# EAGLE schematic New_Point_Absorber (EAGLE 9.5.2)
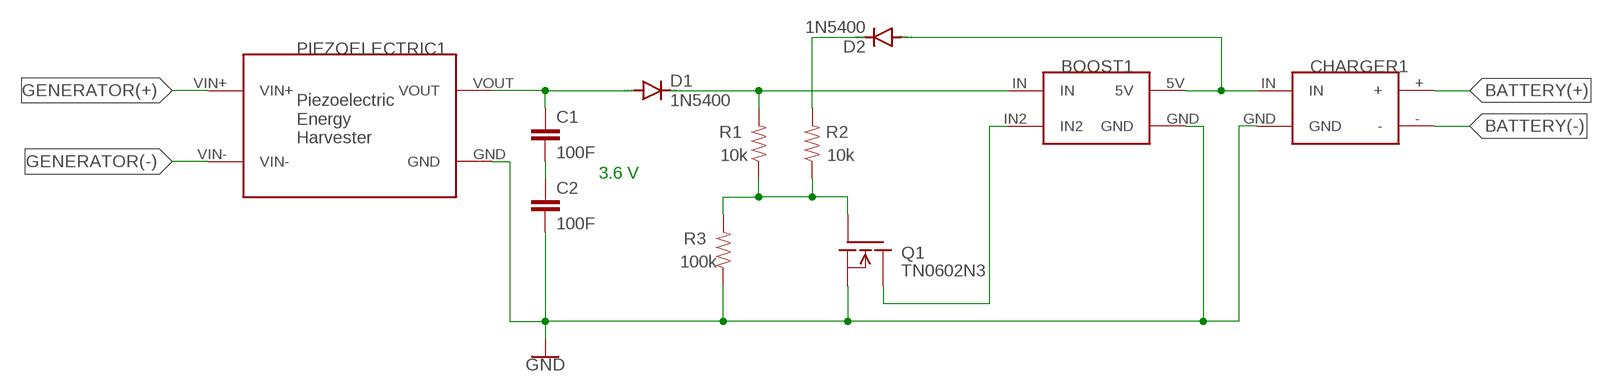
[diagram p0: schematic, sheet 1]

## Parts
BOOST1  BOOST  [BOOST]
C1  100F  47NF-0603-25V-5%  [0603]
C2  100F  47NF-0603-25V-5%  [0603]
CHARGER1  CHARGER  [CHARGER]
D1  1N5400  [DO201-15]
D2  1N5400  [DO201-15]
PIEZOELECTRIC1  PIEZOELECTRIC  [PIEZOELECTRIC]
Q1  TN0602N3  [TO-92]
R1  10k  1KOHM-HORIZ-1/4W-1%  [AXIAL-0.3]
R2  10k  1KOHM-HORIZ-1/4W-1%  [AXIAL-0.3]
R3  100k  1KOHM-HORIZ-1/4W-1%  [AXIAL-0.3]

## Nets
BATTERY(+): CHARGER1.+
BATTERY(-): CHARGER1.-
GENERATOR(+): PIEZOELECTRIC1.VIN+
GENERATOR(-): PIEZOELECTRIC1.VIN-
GND: BOOST1.GND C2.2 CHARGER1.GND PIEZOELECTRIC1.GND Q1.1(S) R3.P$1
N$1: C1.2 C2.1
N$2: BOOST1.IN2 Q1.3(D)
N$3: BOOST1.IN D1.C R1.P$2
N$4: Q1.2(G) R1.P$1 R2.P$1 R3.P$2
N$5: D2.C R2.P$2
N$7: BOOST1.5V CHARGER1.IN D2.A
V_OUT: C1.1 D1.A PIEZOELECTRIC1.VOUT

## Notes on the sheet
- 3.6 V

## Library data of the parts
BOOST1 = Point_Absorber:BOOST
C1 C2 = SparkFun-Capacitors:47NF: 47nF ceramic capacitors A capacitor is a passive two-terminal electrical component used to store electrical energy temporarily in an electric field.; PROD_ID: CAP-08605; VALUE: 47nF
CHARGER1 = Point_Absorber:CHARGER
D1 D2 = diode:1N5400: DIODE standard rectifier, 3 A, 50 V (Motorola)
PIEZOELECTRIC1 = Point_Absorber:PIEZOELECTRIC
Q1 = transistor-fet:TN0602N3: N-Channel Enhancement MOSFET 20V; 4A; 0,75Ohm
R1-R3 = SparkFun-Resistors:1KOHM: 1kΩ resistor A resistor is a passive two-terminal electrical component that implements electrical resistance as a circuit element. Resistors act to reduce current flow, and, at the same time, act to lower voltage levels within circuits. - Wikipedia; PROD_ID: RES-12182; VALUE: 1k

## Module ADAFRUIT_MICRO-LIPO_CHARGER
Ports: 

### Library data of the parts